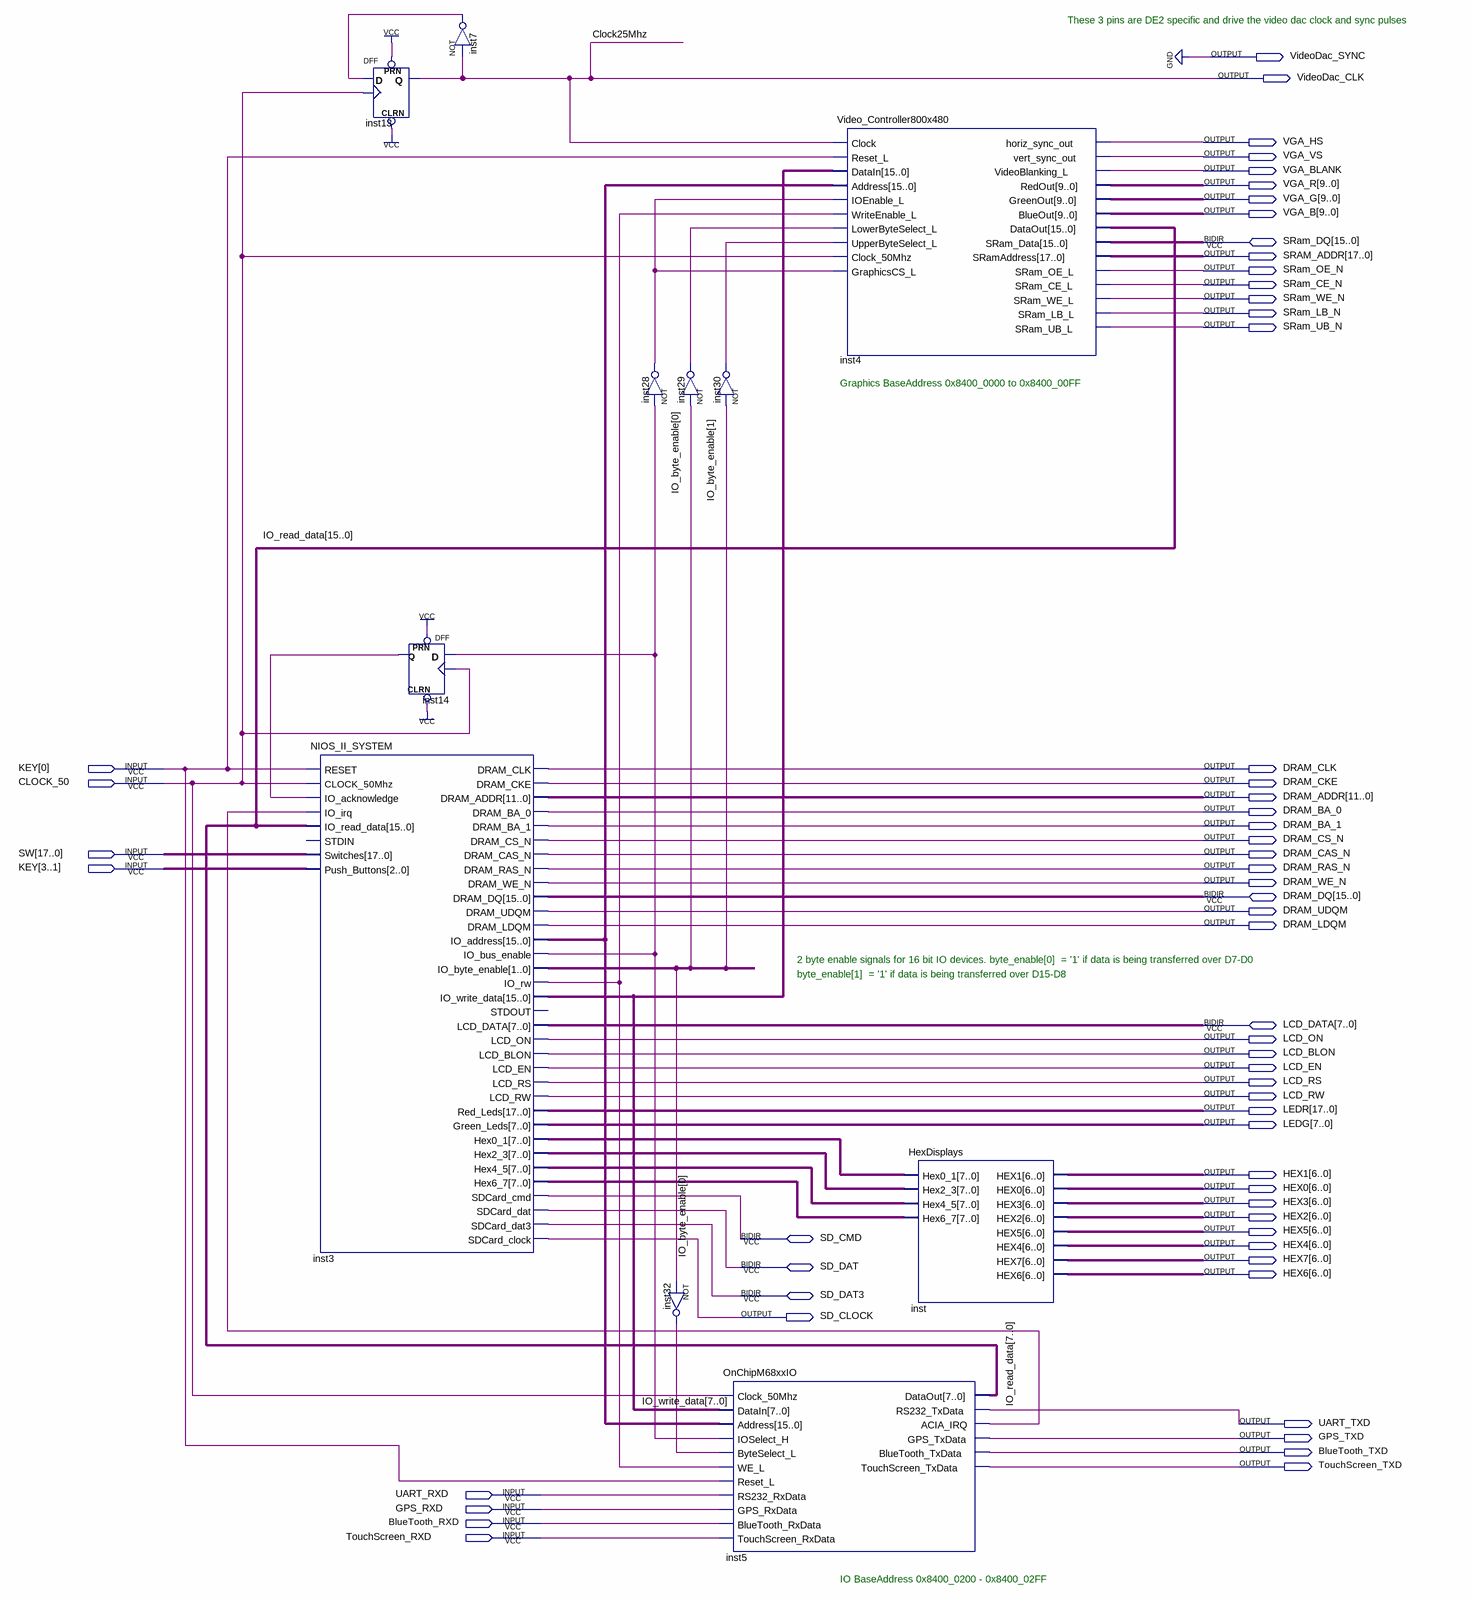
[diagram p0: schematic sheet]
// Quartus schematic SystemTopLevel.bdf as structural Verilog: 11 symbols, 59 pins
module SystemTopLevel (
  input  [3:0] KEY,
  input  CLOCK_50,
  input  [17:0] SW,
  input  UART_RXD,
  input  GPS_RXD,
  input  BlueTooth_RXD,
  input  TouchScreen_RXD,
  inout  [15:0] SRam_DQ,
  inout  [15:0] DRAM_DQ,
  inout  [7:0] LCD_DATA,
  inout  SD_CMD,
  inout  SD_DAT,
  inout  SD_DAT3,
  output VideoDac_SYNC,
  output VideoDac_CLK,
  output VGA_HS,
  output VGA_VS,
  output VGA_BLANK,
  output [9:0] VGA_R,
  output [9:0] VGA_G,
  output [9:0] VGA_B,
  output [17:0] SRAM_ADDR,
  output SRam_OE_N,
  output SRam_CE_N,
  output SRam_WE_N,
  output SRam_LB_N,
  output SRam_UB_N,
  output DRAM_CLK,
  output DRAM_CKE,
  output [11:0] DRAM_ADDR,
  output DRAM_BA_0,
  output DRAM_BA_1,
  output DRAM_CS_N,
  output DRAM_CAS_N,
  output DRAM_RAS_N,
  output DRAM_WE_N,
  output DRAM_UDQM,
  output DRAM_LDQM,
  output LCD_ON,
  output LCD_BLON,
  output LCD_EN,
  output LCD_RS,
  output LCD_RW,
  output [17:0] LEDR,
  output [7:0] LEDG,
  output [6:0] HEX1,
  output [6:0] HEX0,
  output [6:0] HEX3,
  output [6:0] HEX2,
  output [6:0] HEX5,
  output [6:0] HEX4,
  output [6:0] HEX7,
  output [6:0] HEX6,
  output SD_CLOCK,
  output UART_TXD,
  output GPS_TXD,
  output BlueTooth_TXD,
  output TouchScreen_TXD
);

  wire inst3_io_bus_enable, inst3_io_rw, inst5_acia_irq, inst7_out, inst14_q, inst28_out, inst29_out,
       inst30_out, inst32_out;
  wire [1:0] IO_byte_enable;
  wire [7:0] inst3_hex0_1, inst3_hex2_3, inst3_hex4_5, inst3_hex6_7;
  wire [15:0] inst3_io_address, IO_read_data, IO_write_data;

  NIOS_II_SYSTEM inst3 (
    .RESET(KEY[0]), .CLOCK_50Mhz(CLOCK_50), .IO_acknowledge(inst14_q), .IO_irq(inst5_acia_irq),
    .IO_read_data(IO_read_data), .Switches(SW), .Push_Buttons(KEY[3:1]), .DRAM_CLK(DRAM_CLK),
    .DRAM_CKE(DRAM_CKE), .DRAM_ADDR(DRAM_ADDR), .DRAM_BA_0(DRAM_BA_0), .DRAM_BA_1(DRAM_BA_1),
    .DRAM_CS_N(DRAM_CS_N), .DRAM_CAS_N(DRAM_CAS_N), .DRAM_RAS_N(DRAM_RAS_N), .DRAM_WE_N(DRAM_WE_N),
    .DRAM_UDQM(DRAM_UDQM), .DRAM_LDQM(DRAM_LDQM), .IO_address(inst3_io_address),
    .IO_bus_enable(inst3_io_bus_enable), .IO_byte_enable(IO_byte_enable), .IO_rw(inst3_io_rw),
    .IO_write_data(IO_write_data), .LCD_ON(LCD_ON), .LCD_BLON(LCD_BLON), .LCD_EN(LCD_EN), .LCD_RS(LCD_RS),
    .LCD_RW(LCD_RW), .Red_Leds(LEDR), .Green_Leds(LEDG), .Hex0_1(inst3_hex0_1), .Hex2_3(inst3_hex2_3),
    .Hex4_5(inst3_hex4_5), .Hex6_7(inst3_hex6_7), .SDCard_clock(SD_CLOCK), .DRAM_DQ(DRAM_DQ),
    .LCD_DATA(LCD_DATA), .SDCard_cmd(SD_CMD), .SDCard_dat(SD_DAT), .SDCard_dat3(SD_DAT3));  // open: STDIN, STDOUT
  DFF inst13 (.CLRN(1'b1), .CLK(CLOCK_50), .D(inst7_out), .PRN(1'b1), .Q(VideoDac_CLK));
  DFF inst14 (.CLRN(1'b1), .CLK(CLOCK_50), .D(inst3_io_bus_enable), .PRN(1'b1), .Q(inst14_q));
  not inst7 (inst7_out, VideoDac_CLK);
  not inst28 (inst28_out, inst3_io_bus_enable);
  not inst29 (inst29_out, IO_byte_enable[0]);
  not inst32 (inst32_out, IO_byte_enable[0]);
  not inst30 (inst30_out, IO_byte_enable[1]);
  OnChipM68xxIO inst5 (
    .Clock_50Mhz(CLOCK_50), .DataIn(IO_write_data[7:0]), .Address(inst3_io_address),
    .IOSelect_H(inst3_io_bus_enable), .ByteSelect_L(inst32_out), .WE_L(inst3_io_rw), .Reset_L(KEY[0]),
    .RS232_RxData(UART_RXD), .GPS_RxData(GPS_RXD), .BlueTooth_RxData(BlueTooth_RXD),
    .TouchScreen_RxData(TouchScreen_RXD), .DataOut(IO_read_data[7:0]), .RS232_TxData(UART_TXD),
    .ACIA_IRQ(inst5_acia_irq), .GPS_TxData(GPS_TXD), .BlueTooth_TxData(BlueTooth_TXD),
    .TouchScreen_TxData(TouchScreen_TXD));
  Video_Controller800x480 inst4 (
    .Clock(VideoDac_CLK), .Reset_L(KEY[0]), .DataIn(IO_write_data), .Address(inst3_io_address),
    .IOEnable_L(inst28_out), .WriteEnable_L(inst3_io_rw), .LowerByteSelect_L(inst29_out),
    .UpperByteSelect_L(inst30_out), .Clock_50Mhz(CLOCK_50), .GraphicsCS_L(inst28_out),
    .horiz_sync_out(VGA_HS), .vert_sync_out(VGA_VS), .VideoBlanking_L(VGA_BLANK), .RedOut(VGA_R),
    .GreenOut(VGA_G), .BlueOut(VGA_B), .DataOut(IO_read_data), .SRamAddress(SRAM_ADDR),
    .SRam_OE_L(SRam_OE_N), .SRam_CE_L(SRam_CE_N), .SRam_WE_L(SRam_WE_N), .SRam_LB_L(SRam_LB_N),
    .SRam_UB_L(SRam_UB_N), .SRam_Data(SRam_DQ));
  HexDisplays inst (
    .Hex0_1(inst3_hex0_1), .Hex2_3(inst3_hex2_3), .Hex4_5(inst3_hex4_5), .Hex6_7(inst3_hex6_7), .HEX1(HEX1),
    .HEX0(HEX0), .HEX3(HEX3), .HEX2(HEX2), .HEX5(HEX5), .HEX4(HEX4), .HEX7(HEX7), .HEX6(HEX6));

  assign VideoDac_SYNC = 1'b0;

  // Other names for the same wires on the sheet: Clock25Mhz = VideoDac_CLK

  // Notes on the sheet:
  //   These 3 pins are DE2 specific and drive the video dac clock and sync pulses
  //   Graphics BaseAddress 0x8400_0000 to 0x8400_00FF
  //   2 byte enable signals for 16 bit IO devices. byte_enable[0]  = '1' if data is being transferred over D7-D0
  //   byte_enable[1]  = '1' if data is being transferred over D15-D8
  //   IO BaseAddress 0x8400_0200 - 0x8400_02FF
endmodule
